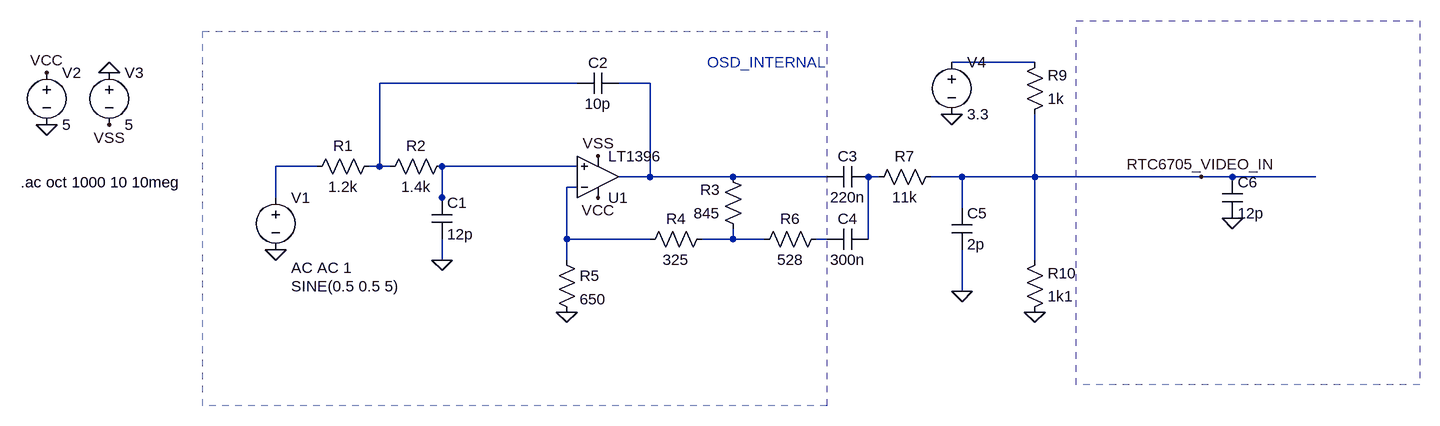
[diagram p0: schematic video_amp_high_impedance.asc]
video_amp_high_impedance.asc, the LTspice schematic file:
Version 4
SHEET 1 1540 680
WIRE 944 0 816 0
WIRE 240 32 -64 32
WIRE 352 32 304 32
WIRE -160 160 -224 160
WIRE -64 160 -64 32
WIRE -64 160 -80 160
WIRE -48 160 -64 160
WIRE 240 160 32 160
WIRE 352 176 352 32
WIRE 352 176 304 176
WIRE 480 176 352 176
WIRE 624 176 480 176
WIRE 704 176 688 176
WIRE 832 176 784 176
WIRE 944 176 944 80
WIRE 944 176 832 176
WIRE 1200 176 944 176
WIRE 1248 176 1200 176
WIRE 1376 176 1248 176
WIRE 240 192 224 192
WIRE -224 208 -224 160
WIRE 32 208 32 160
WIRE 32 224 32 208
WIRE 832 224 832 176
WIRE 224 272 224 192
WIRE 352 272 224 272
WIRE 480 272 480 256
WIRE 480 272 432 272
WIRE 528 272 480 272
WIRE 624 272 608 272
WIRE 688 272 688 176
WIRE 32 304 32 272
WIRE 224 304 224 272
WIRE 944 304 944 176
WIRE 832 352 832 288
FLAG -224 288 0
FLAG 32 304 0
FLAG 224 384 0
FLAG -576 96 0
FLAG -480 16 0
FLAG -576 16 VCC
FLAG -480 96 VSS
FLAG 272 208 VCC
FLAG 272 144 VSS
FLAG 944 384 0
FLAG 816 80 0
FLAG 1200 176 RTC6705_VIDEO_IN
FLAG 1248 240 0
FLAG 832 352 0
SYMBOL Opamps\\LT1396 272 240 M180
SYMATTR InstName U1
SYMBOL voltage -224 192 R0
WINDOW 3 24 152 Left 2
WINDOW 123 24 124 Left 2
WINDOW 39 0 0 Left 2
SYMATTR Value SINE(0.5 0.5 5)
SYMATTR Value2 AC AC 1
SYMATTR InstName V1
SYMBOL res -64 144 R90
WINDOW 0 0 56 VBottom 2
WINDOW 3 32 56 VTop 2
SYMATTR InstName R1
SYMATTR Value 1.2k
SYMBOL res 48 144 R90
WINDOW 0 0 56 VBottom 2
WINDOW 3 32 56 VTop 2
SYMATTR InstName R2
SYMATTR Value 1.4k
SYMBOL cap 16 208 R0
SYMATTR InstName C1
SYMATTR Value 12p
SYMBOL cap 304 16 R90
WINDOW 0 0 32 VBottom 2
WINDOW 3 32 32 VTop 2
SYMATTR InstName C2
SYMATTR Value 10p
SYMBOL res 496 272 R180
WINDOW 0 36 76 Left 2
WINDOW 3 36 40 Left 2
SYMATTR InstName R3
SYMATTR Value 845
SYMBOL res 336 288 R270
WINDOW 0 32 56 VTop 2
WINDOW 3 0 56 VBottom 2
SYMATTR InstName R4
SYMATTR Value 325
SYMBOL res 208 288 R0
SYMATTR InstName R5
SYMATTR Value 650
SYMBOL res 512 288 R270
WINDOW 0 32 56 VTop 2
WINDOW 3 0 56 VBottom 2
SYMATTR InstName R6
SYMATTR Value 528
SYMBOL voltage -576 0 R0
WINDOW 123 0 0 Left 2
WINDOW 39 0 0 Left 2
SYMATTR InstName V2
SYMATTR Value 5
SYMBOL voltage -480 0 R0
WINDOW 123 0 0 Left 2
WINDOW 39 0 0 Left 2
SYMATTR InstName V3
SYMATTR Value 5
SYMBOL res 800 160 R90
WINDOW 0 0 56 VBottom 2
WINDOW 3 32 56 VTop 2
SYMATTR InstName R7
SYMATTR Value 11k
SYMBOL cap 688 160 R90
WINDOW 0 0 32 VBottom 2
WINDOW 3 32 32 VTop 2
SYMATTR InstName C3
SYMATTR Value 220n
SYMATTR SpiceLine V=4 Irms=16.4 Rser=0.00218555 Lser=0
SYMBOL cap 688 256 R90
WINDOW 0 0 32 VBottom 2
WINDOW 3 32 32 VTop 2
SYMATTR InstName C4
SYMATTR Value 300n
SYMATTR SpiceLine V=4 Irms=16.4 Rser=0.00218555 Lser=0
SYMBOL res 928 96 M180
WINDOW 0 36 76 Left 2
WINDOW 3 36 40 Left 2
SYMATTR InstName R9
SYMATTR Value 1k
SYMBOL res 928 400 M180
WINDOW 0 36 76 Left 2
WINDOW 3 36 40 Left 2
SYMATTR InstName R10
SYMATTR Value 1k1
SYMBOL voltage 816 -16 R0
WINDOW 123 0 0 Left 2
WINDOW 39 0 0 Left 2
SYMATTR InstName V4
SYMATTR Value 3.3
SYMBOL cap 1232 176 R0
SYMATTR InstName C6
SYMATTR Value 12p
SYMBOL cap 816 224 R0
SYMATTR InstName C5
SYMATTR Value 2p
TEXT -616 184 Left 2 !.ac oct 1000 10 10meg
TEXT 440 0 Left 2 ;OSD_INTERNAL
RECTANGLE Normal 624 528 -336 -48 2
RECTANGLE Normal 1536 496 1008 -64 2

The netlist it stands for:
* video_amp_high_impedance.asc
XU1 N005 N007 VCC VSS N003 LT1396  ; pins In+ In- V+ V- OUT
V1 N004 0 SINE(0.5 0.5 5) AC AC 1
R1 N002 N004 1.2k
R2 N005 N002 1.4k
C1 N005 0 12p
C2 N003 N002 10p
R3 N008 N003 845
R4 N007 N008 325
R5 N007 0 650
R6 N008 N009 528
V2 VCC 0 5
V3 0 VSS 5
R7 RTC6705_VIDEO_IN N006 11k
C3 N006 N003 220n V=4 Irms=16.4 Rser=0.00218555 Lser=0
C4 N006 N009 300n V=4 Irms=16.4 Rser=0.00218555 Lser=0
R9 RTC6705_VIDEO_IN N001 1k
R10 0 RTC6705_VIDEO_IN 1k1
V4 N001 0 3.3
C6 RTC6705_VIDEO_IN 0 12p
C5 RTC6705_VIDEO_IN 0 2p
.ac oct 1000 10 10meg
* OSD_INTERNAL
.backanno
.end